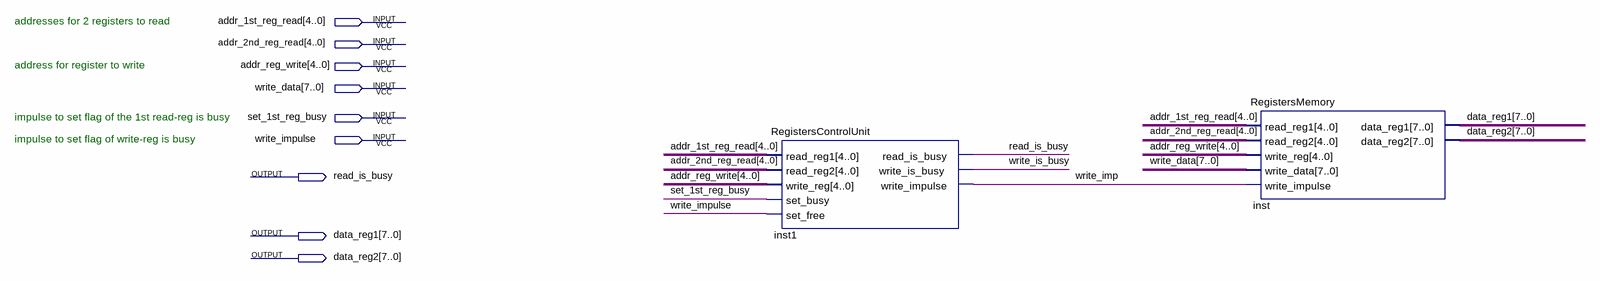
[diagram p0: schematic sheet]
// Quartus schematic Registers.bdf as structural Verilog: 2 symbols, 9 pins
module Registers (
  input  [4:0] addr_1st_reg_read,
  input  [4:0] addr_2nd_reg_read,
  input  [4:0] addr_reg_write,
  input  [7:0] write_data,
  input  set_1st_reg_busy,
  input  write_impulse,
  output read_is_busy,
  output [7:0] data_reg1,
  output [7:0] data_reg2
);

  wire write_imp, write_is_busy;

  RegistersControlUnit inst1 (
    .read_reg1(addr_1st_reg_read), .read_reg2(addr_2nd_reg_read), .write_reg(addr_reg_write),
    .set_busy(set_1st_reg_busy), .set_free(write_impulse), .read_is_busy(read_is_busy),
    .write_is_busy(write_is_busy), .write_impulse(write_imp));
  RegistersMemory inst (
    .read_reg1(addr_1st_reg_read), .read_reg2(addr_2nd_reg_read), .write_reg(addr_reg_write),
    .write_data(write_data), .write_impulse(write_imp), .data_reg1(data_reg1), .data_reg2(data_reg2));

  // Notes on the sheet:
  //   addresses for 2 registers to read
  //   address for register to write
  //   impulse to set flag of the 1st read-reg is busy
  //   impulse to set flag of write-reg is busy
endmodule
